# Altium schematic sheet 韦根输入输出.SchDoc
size A3
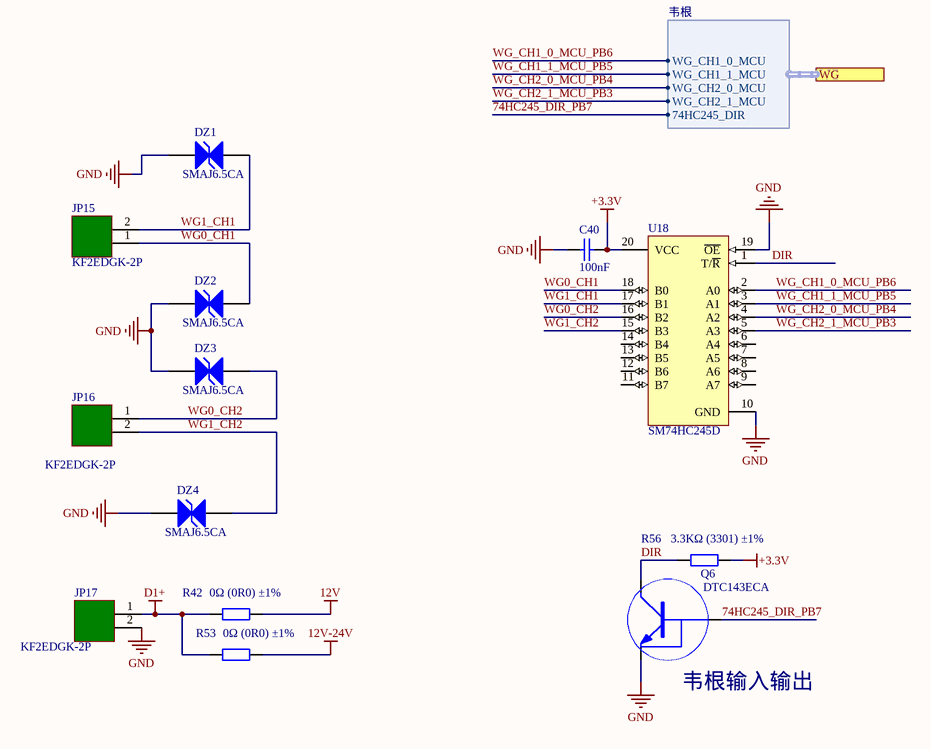
[diagram p0: 韦根输入输出.SchDoc]

## Parts
C40  100nF  [0603_C]
DZ1  SMAJ6.5CA  [LC-SMA(DO-214AC)_S1]
DZ2  SMAJ6.5CA  [LC-SMA(DO-214AC)_S1]
DZ3  SMAJ6.5CA  [LC-SMA(DO-214AC)_S1]
DZ4  SMAJ6.5CA  [LC-SMA(DO-214AC)_S1]
JP15  KF2EDGK-2P  [KF2EDGK5.08W-2P]
JP16  KF2EDGK-2P  [KF2EDGK5.08W-2P]
JP17  KF2EDGK-2P  [KF2EDGK5.08W-2P]
Q6  DTC143ECA
R42  0Ω (0R0) ±1%  [1206_R]
R53  0Ω (0R0) ±1%  [1206_R]
R56  3.3KΩ (3301) ±1%  [0603_R]
U18  SM74HC245D  [SOIC-20_300mil]

## Ports
WG (harness 韦根)

## Harnesses
韦根: WG_CH1_0_MCU, WG_CH1_1_MCU, WG_CH2_0_MCU, WG_CH2_1_MCU, 74HC245_DIR

## Nets
12V: R42.2
12V-24V: R53.2
+3.3V: C40.1 R56.2 U18.20(VCC)
D1+: JP17.1 R42.1 R53.1
GND: C40.2 DZ1.1(A) DZ2.1(A) DZ3.1(A) DZ4.1(A) JP17.2 Q6.2(GND) U18.10(GND) U18.19(~{OE})
74HC245_DIR_PB7: Q6.1(IN) ; port WG.74HC245_DIR
DIR: Q6.3(OUT) R56.1 U18.1(T/~{R})
WG0_CH1: DZ2.2(K) JP15.1 U18.18(B0)
WG0_CH2: DZ3.2(K) JP16.1 U18.16(B2)
WG1_CH1: DZ1.2(K) JP15.2 U18.17(B1)
WG1_CH2: DZ4.2(K) JP16.2 U18.15(B3)
WG_CH1_0_MCU_PB6: U18.2(A0) ; port WG.WG_CH1_0_MCU
WG_CH1_1_MCU_PB5: U18.3(A1) ; port WG.WG_CH1_1_MCU
WG_CH2_0_MCU_PB4: U18.4(A2) ; port WG.WG_CH2_0_MCU
WG_CH2_1_MCU_PB3: U18.5(A3) ; port WG.WG_CH2_1_MCU

Not connected (* = marked no-connect by the designer): U18 6(A4) 7(A5) 8(A6) 9(A7) 11(B7) 12(B6) 13(B5) 14(B4)

## Notes on the sheet
- (near Q6) 韦根输入输出

## Library data of the parts
C40 = 0603 100nF (104) 10% 50V: 贴片电容; ComponentLink1Description: 供应商链接; ComponentLink1URL: http://www.szlcsc.com/product/details_15331.html; Package: 0603; Supplier: LC; SuppliersPartNumber: C14663
DZ1-DZ4 = SMB/DO-214AA P6SMB6.8CA: TVS; ComponentLink1Description: 供应商链接; ComponentLink1URL: http://www.szlcsc.com/product/details_79530.html; Package: SMB/DO-214AA; Supplier: LC; SuppliersPartNumber: C78395
Q6 = DTC143ECA: NPN集成三极管
R42 R53 = 1206 0Ω (0R0) 1%: 贴片电阻; ComponentLink1Description: 供应商链接; ComponentLink1URL: http://www.szlcsc.com/product/details_18576.html; Package: 1206; Supplier: LC; SuppliersPartNumber: C17888
R56 = 0603 3.3KΩ (3301) 1%: 贴片电阻; ComponentLink1Description: 供应商链接; ComponentLink1URL: http://www.szlcsc.com/product/details_23705.html; Package: 0603; Supplier: LC; SuppliersPartNumber: C22978
U18 = 74HC245D: 74系列逻辑芯片; ComponentLink1Description: 供应商链接; ComponentLink1URL: http://www.szlcsc.com/product/details_6076.html; Package: SOIC-20_300mil; Supplier: LC; SuppliersPartNumber: C5625